# Altium schematic sheet SD card.SchDoc
size A4
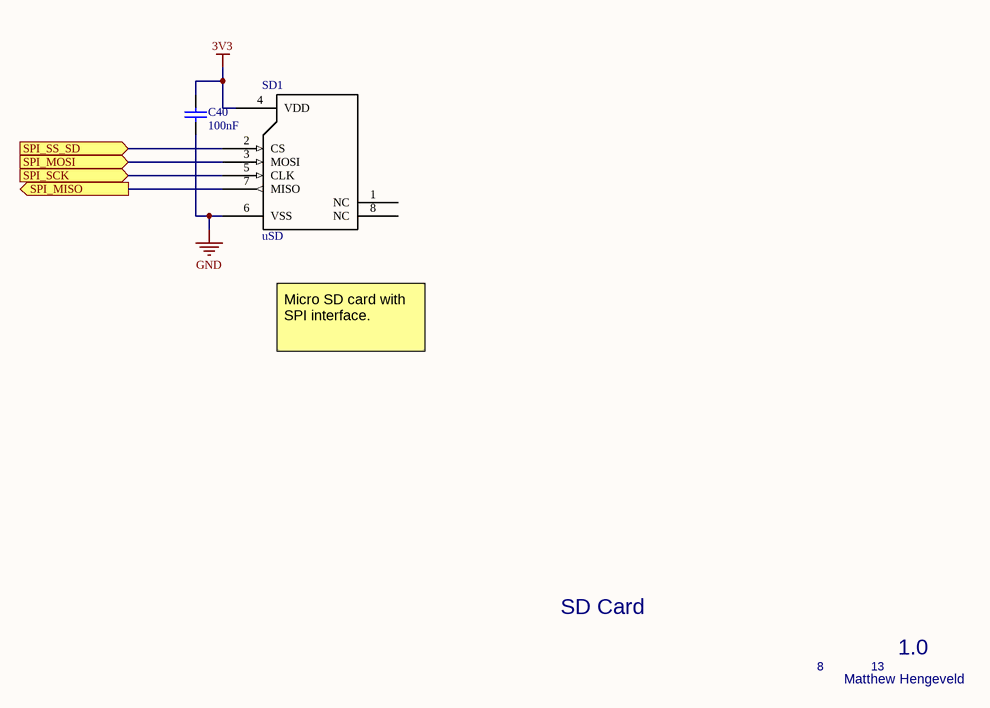
[diagram p0: SD card.SchDoc]

## Parts
C40  100nF  [CAPC1608X92X38LL15T08]
SD1  uSD  [uSD]

## Ports
SPI_MISO (out), SPI_MOSI (in), SPI_SCK (in), SPI_SS_SD (in)

## Nets
3V3: C40.2 SD1.4(VDD)
GND: C40.1 SD1.6(VSS)
SPI_MISO: SD1.7(MISO) ; port SPI_MISO
SPI_MOSI: SD1.3(MOSI) ; port SPI_MOSI
SPI_SCK: SD1.5(CLK) ; port SPI_SCK
SPI_SS_SD: SD1.2(CS) ; port SPI_SS_SD

Not connected (* = marked no-connect by the designer): SD1 1(NC) 8(NC)

## Notes on the sheet
- Micro SD card with SPI interface.
- SD Card
- 8
- 13
- 1.0
- Matthew Hengeveld

## Library data of the parts
C40 = CMP-2006-01974-1: Part Number: VJ0603Y104KNXAO; Manufacturer: Vitramon
SD1 = MicroSD Holder: uSD Card Holder, SPI Interface